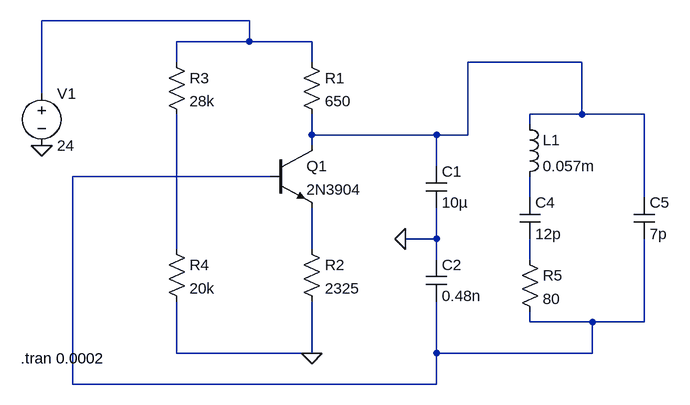
[diagram p0: schematic Crystal oscillator.asc]
Crystal oscillator.asc, the LTspice schematic file:
Version 4
SHEET 1 880 680
WIRE 48 -112 -272 -112
WIRE 48 -80 48 -112
WIRE 48 -80 -64 -80
WIRE 144 -80 48 -80
WIRE -64 -48 -64 -80
WIRE 144 -48 144 -80
WIRE 560 -48 384 -48
WIRE -272 0 -272 -112
WIRE 560 32 560 -48
WIRE 560 32 480 32
WIRE 656 32 560 32
WIRE 480 48 480 32
WIRE 144 64 144 32
WIRE 336 64 144 64
WIRE 384 64 384 -48
WIRE 384 64 336 64
WIRE 144 80 144 64
WIRE 336 112 336 64
WIRE 80 128 -224 128
WIRE 480 160 480 128
WIRE 656 160 656 32
WIRE 336 224 336 176
WIRE 336 224 288 224
WIRE -64 240 -64 32
WIRE 144 240 144 176
WIRE 336 256 336 224
WIRE 480 256 480 224
WIRE 480 352 480 336
WIRE 576 352 480 352
WIRE 656 352 656 224
WIRE 656 352 576 352
WIRE -64 400 -64 320
WIRE 144 400 144 320
WIRE 144 400 -64 400
WIRE 336 400 336 320
WIRE 576 400 576 352
WIRE 576 400 336 400
WIRE -224 448 -224 128
WIRE 336 448 336 400
WIRE 336 448 -224 448
FLAG -272 80 0
FLAG 288 224 0
FLAG 144 400 0
SYMBOL npn 80 80 R0
SYMATTR InstName Q1
SYMATTR Value 2N3904
SYMBOL res 128 -64 R0
SYMATTR InstName R1
SYMATTR Value 650
SYMBOL res 128 224 R0
SYMATTR InstName R2
SYMATTR Value 2325
SYMBOL res -80 -64 R0
SYMATTR InstName R3
SYMATTR Value 28k
SYMBOL res -80 224 R0
SYMATTR InstName R4
SYMATTR Value 20k
SYMBOL cap 320 112 R0
SYMATTR InstName C1
SYMATTR Value 10µ
SYMBOL cap 320 256 R0
SYMATTR InstName C2
SYMATTR Value 0.48n
SYMBOL ind 464 32 R0
SYMATTR InstName L1
SYMATTR Value 0.057m
SYMBOL cap 464 160 R0
SYMATTR InstName C4
SYMATTR Value 12p
SYMBOL res 464 240 R0
SYMATTR InstName R5
SYMATTR Value 80
SYMBOL cap 640 160 R0
SYMATTR InstName C5
SYMATTR Value 7p
SYMBOL voltage -272 -16 R0
WINDOW 123 0 0 Left 2
WINDOW 39 0 0 Left 2
SYMATTR InstName V1
SYMATTR Value 24
TEXT -304 408 Left 2 !.tran 0.0002

The netlist it stands for:
* Crystal oscillator.asc
Q1 N002 N003 N006 0 2N3904
R1 N001 N002 650
R2 N006 0 2325
R3 N001 N005 28k
R4 N005 0 20k
C1 N002 0 10µ
C2 0 N003 0.48n
L1 N002 N004 0.057m
C4 N004 N007 12p
R5 N007 N003 80
C5 N002 N003 7p
V1 N001 0 24
.model NPN NPN
.model PNP PNP
.lib standard.bjt
.tran 0.0002
.backanno
.end